# EAGLE schematic EE445L_Baseline_Schematic (EAGLE 9.6.2)
Fall 2021 EE445L This is the baseline schematic
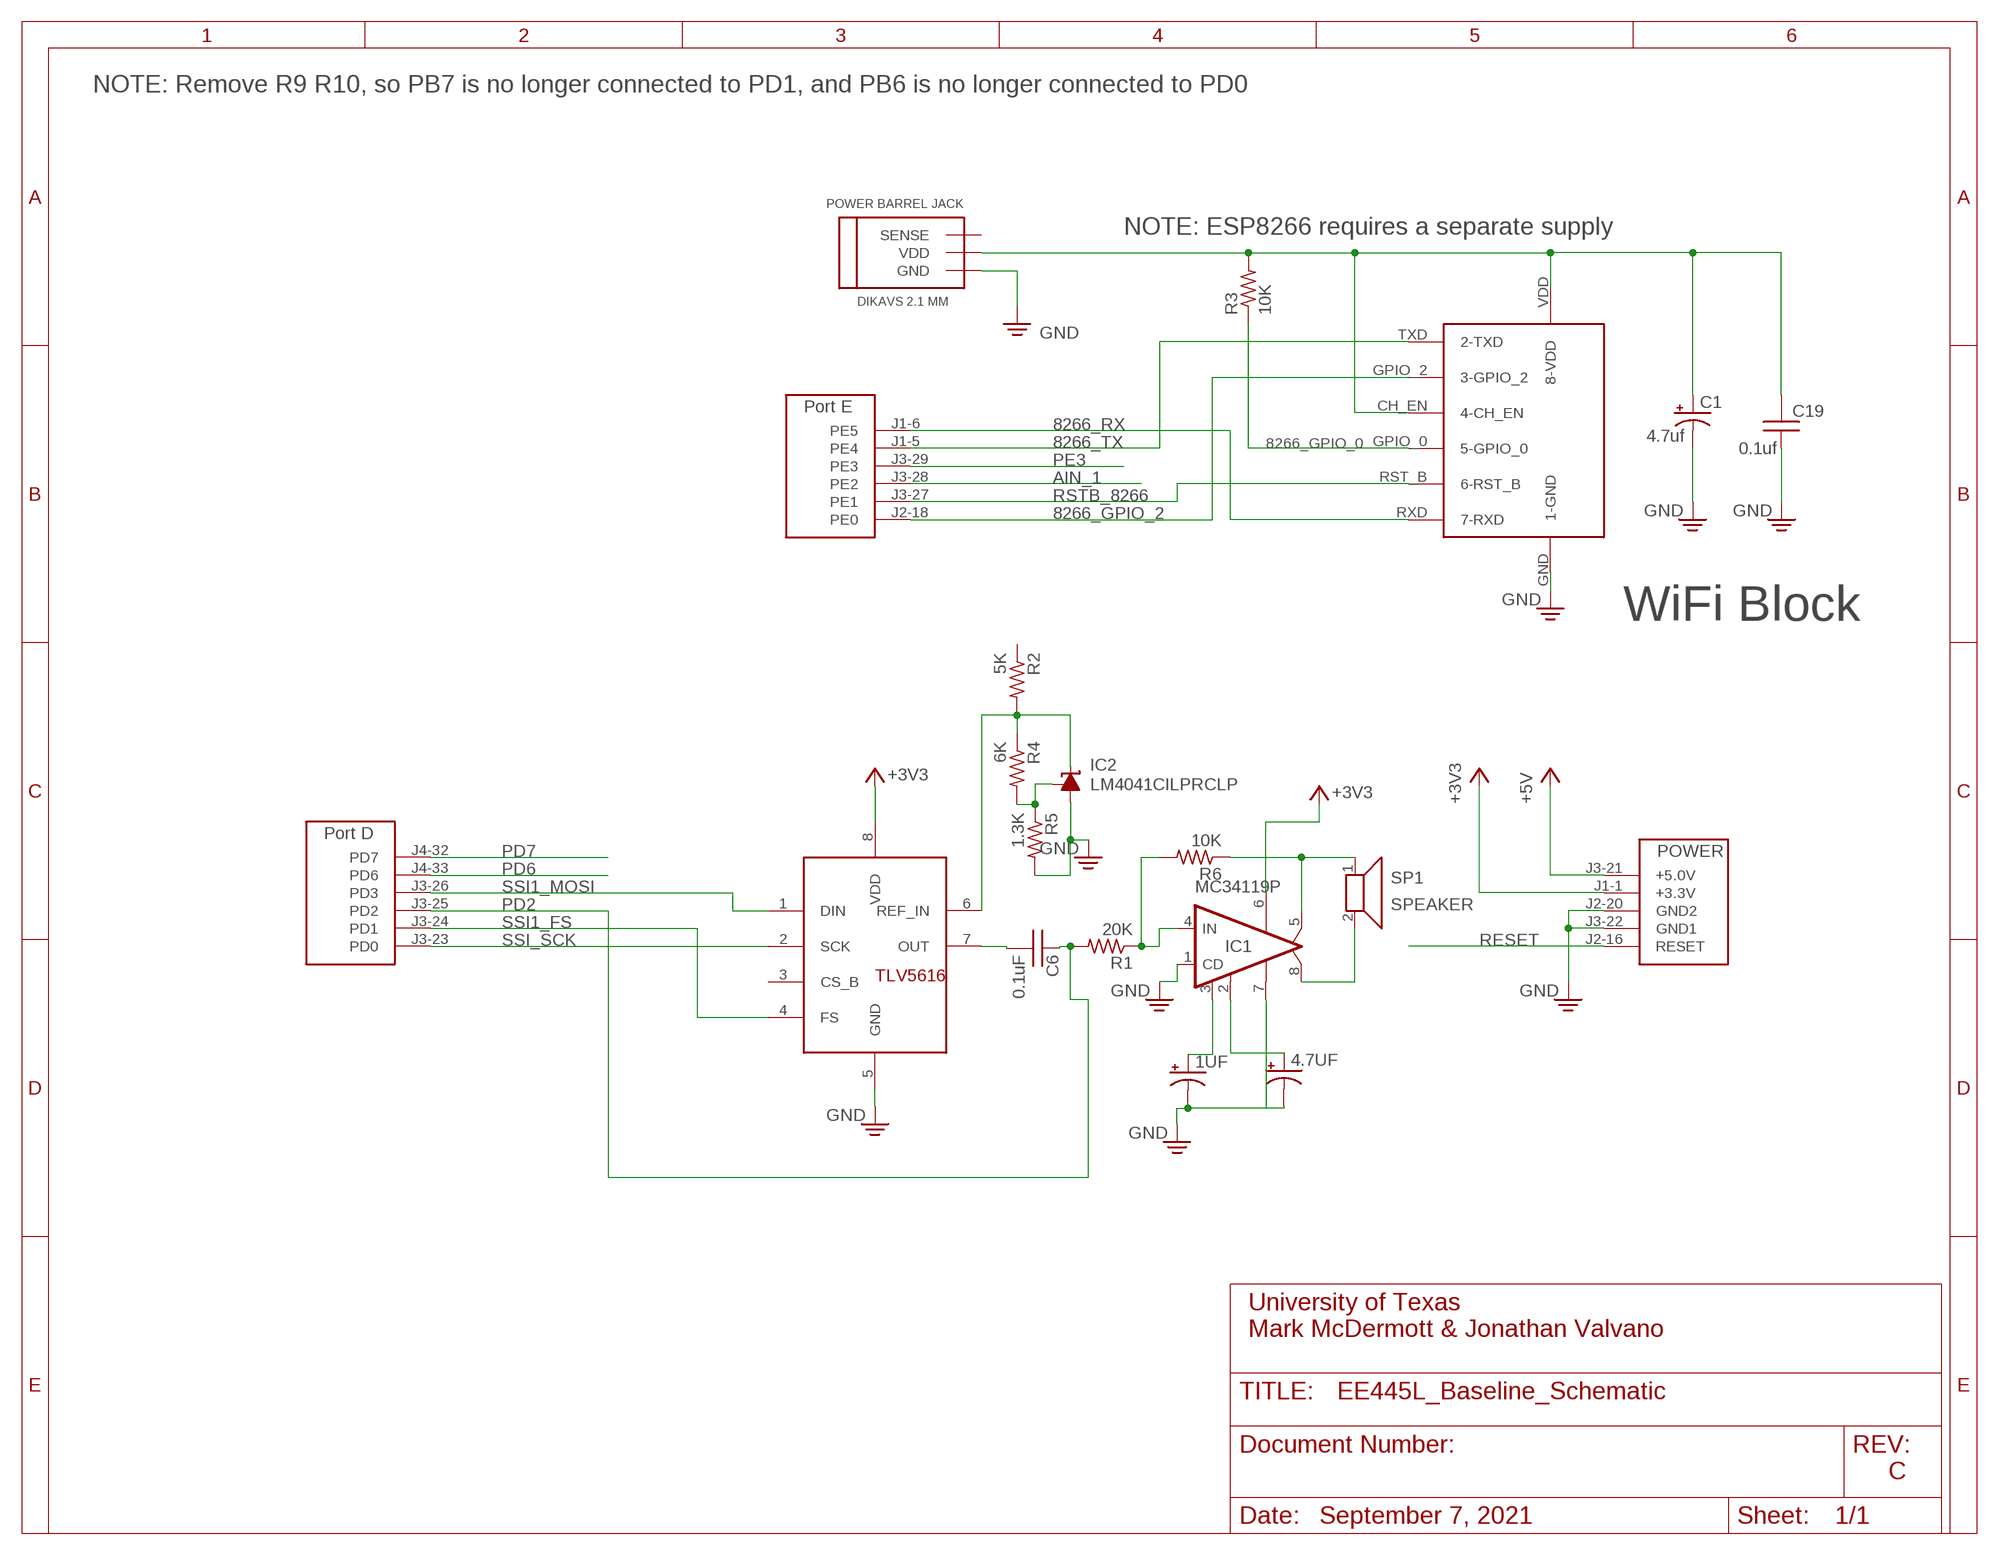
[diagram p0: schematic, sheet 1, part 1 of 2]
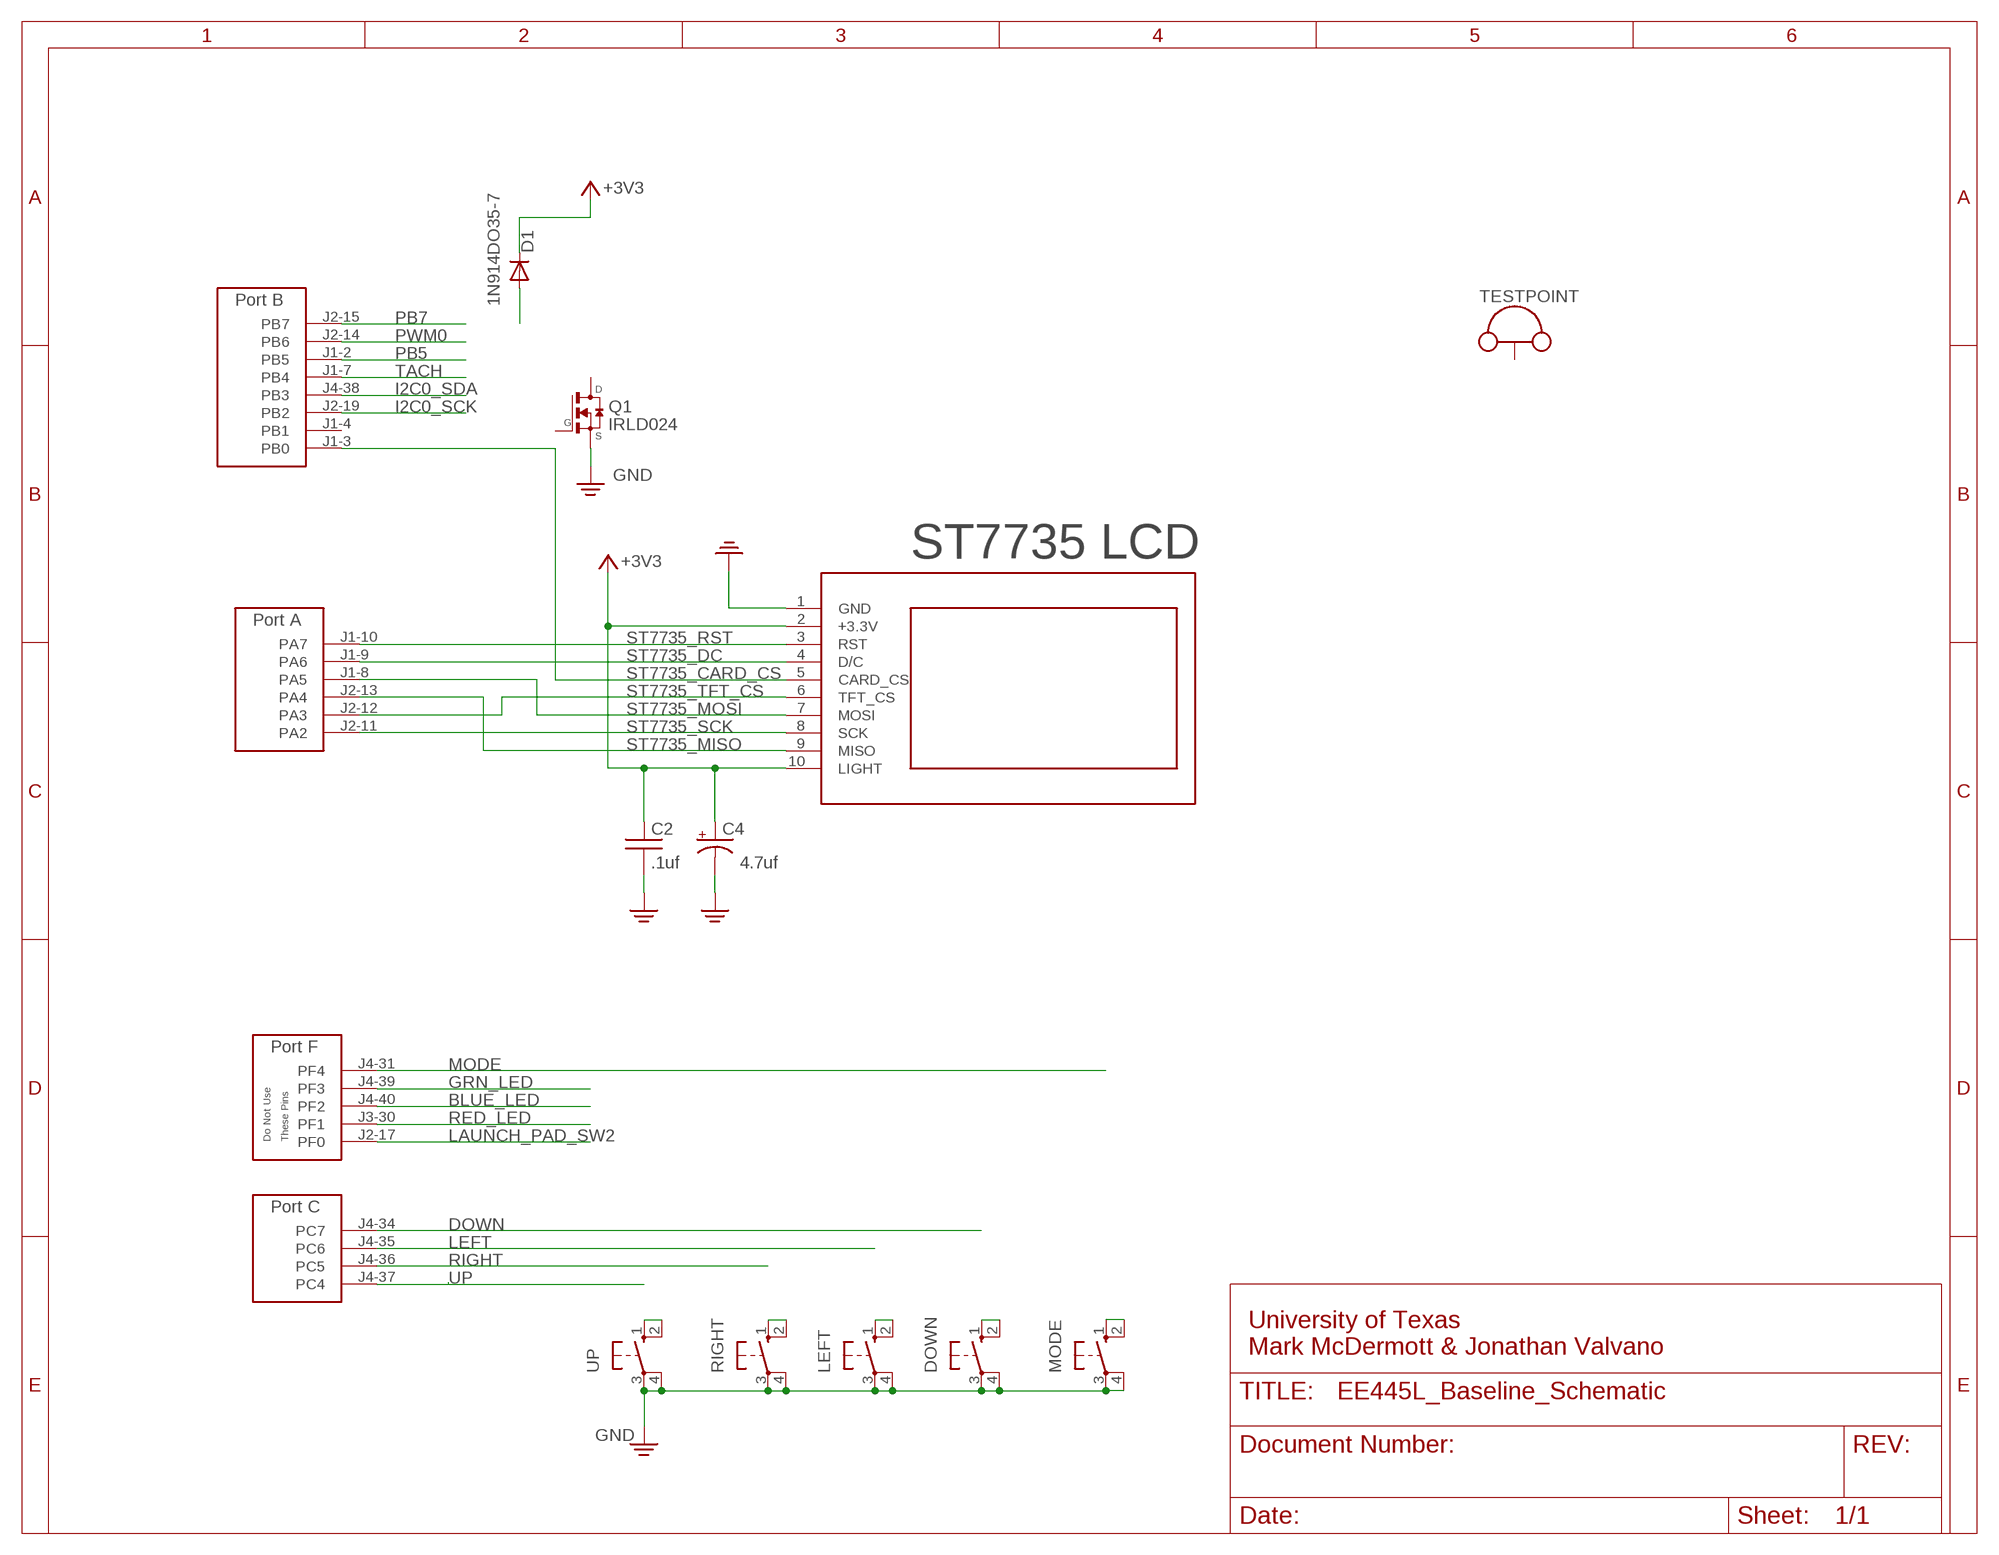
[diagram p1: schematic, sheet 1, part 2 of 2]

## Parts
1UF  CAPACITOR_POLARIZEDE5-6  [CAP200MILPOLARIZED]
4.7UF  CAPACITOR_POLARIZEDE5-6  [CAP200MILPOLARIZED]
C1  4.7uf  CAPACITOR_POLARIZEDE5-6  [CAP200MILPOLARIZED]
C2  .1uf  CAPACITOR050-024X044  [CAP200MIL]
C4  4.7uf  CAPACITOR_POLARIZEDE5-6  [CAP200MILPOLARIZED]
C6  0.1uF  CAPACITOR025-024X044  [CAP100MIL]
C19  0.1uf  CAPACITOR050-024X044  [CAP200MIL]
D1  1N914DO35-7  [DO35-7]
DOWN  B3F-1052  [B3F-10XX]
IC1  MC34119P  [DIL08]
IC2  LM4041CILPRCLP  [LP_O-PBCY-W3]
LEFT  B3F-1052  [B3F-10XX]
MODE  B3F-1052  [B3F-10XX]
Q1  IRLD024  [IRLD024]
R1  20K  RESISTOR0204/7  [RES300MIL]
R2  5K  RESISTOR0204/7  [RES300MIL]
R3  10K  RESISTOR0204/7  [RES300MIL]
R4  6K  RESISTOR0204/7  [RES300MIL]
R5  1.3K  RESISTOR0204/7  [RES300MIL]
R6  10K  RESISTOR0204/7  [RES300MIL]
RIGHT  B3F-1052  [B3F-10XX]
SP1  SPEAKER  [1X02]
TESTPOINT  TP_LOOP  [TP_LOOP]
U$1  ESP_8266  [ESP8266]
U$2  TM4C_BP  [TM4C_BOOSTER_PACK]
U$3  ST7735  [ST7735]
U$4  2.1MM_BARREL_JACK  [2.1M_BARREL_JACK]
U$5  TLV5616  [DIL08]
UP  B3F-1052  [B3F-10XX]

## Nets
8266_GPIO_0: R3.1 U$1.GPIO_0(5-GPIO_0)
8266_GPIO_2: U$1.GPIO_2(3-GPIO_2) U$2.J2-18(PE0)
8266_RX: U$1.RXD(7-RXD) U$2.J1-6(PE5)
8266_TX: U$1.TXD(2-TXD) U$2.J1-5(PE4)
+3V3: C2.1 C4.+ D1.C IC1.6(VCC) U$2.J1-1(+3.3V) U$3.2(+3.3V) U$3.10(LIGHT) U$5.8(VDD)
+5V: U$2.J3-21(+5.0V)
AIN_1: U$2.J3-28(PE2)
BLUE_LED: U$2.J4-40(PF2)
DOWN: U$2.J4-34(PC7)
GND: 1UF.- 4.7UF.- C1.- C2.2 C4.- C19.1 DOWN.3(P) DOWN.4(P1) IC1.1(CD) IC1.7(GND) IC2.3(A) LEFT.3(P) LEFT.4(P1) MODE.3(P) MODE.4(P1) Q1.P$4(S) R5.2 RIGHT.3(P) RIGHT.4(P1) U$1.GND(1-GND) U$2.J2-20(GND2) U$2.J3-22(GND1) U$3.1(GND) U$4.GND U$5.5(GND) UP.3(P) UP.4(P1)
GRN_LED: U$2.J4-39(PF3)
I2C0_SCK: U$2.J2-19(PB2)
I2C0_SDA: U$2.J4-38(PB3)
LAUNCH_PAD_SW2: U$2.J2-17(PF0)
LEFT: U$2.J4-35(PC6)
MODE: U$2.J4-31(PF4)
N$1: IC1.8(VO2) SP1.2
N$2: C1.+ C19.2 R3.2 U$1.CH_EN(4-CH_EN) U$1.VDD(8-VDD) U$4.VDD
N$3: LEFT.1(S) LEFT.2(S1)
N$4: DOWN.1(S) DOWN.2(S1)
N$5: MODE.1(S) MODE.2(S1)
N$6: RIGHT.1(S) RIGHT.2(S1)
N$7: UP.1(S) UP.2(S1)
N$9: C6.2 U$5.7(OUT)
N$10: IC1.4(IN) R1.1 R6.2
N$11: IC2.2(C) R2.2 R4.1 U$5.6(REF_IN)
N$12: 1UF.+ IC1.3(FC1)
N$13: IC2.1(FB) R4.2 R5.1
N$14: 4.7UF.+ IC1.2(FC2)
N$15: IC1.5(VO1) R6.1 SP1.1
N$16: D1.A
PB5: U$2.J1-2(PB5)
PB7: U$2.J2-15(PB7)
PD2: C6.1 R1.2 U$2.J3-25(PD2)
PD6: U$2.J4-33(PD6)
PD7: U$2.J4-32(PD7)
PE3: U$2.J3-29(PE3)
PWM0: U$2.J2-14(PB6)
RED_LED: U$2.J3-30(PF1)
RESET: U$2.J2-16(RESET)
RIGHT: U$2.J4-36(PC5)
RSTB_8266: U$1.RST_B(6-RST_B) U$2.J3-27(PE1)
SSI1_FS: U$2.J3-24(PD1) U$5.4(FS)
SSI1_MOSI: U$2.J3-26(PD3) U$5.1(DIN)
SSI_SCK: U$2.J3-23(PD0) U$5.2(SCK)
ST7735_CARD_CS: U$2.J1-3(PB0) U$3.5(CARD_CS)
ST7735_DC: U$2.J1-9(PA6) U$3.4(D/C)
ST7735_MISO: U$2.J2-13(PA4) U$3.9(MISO)
ST7735_MOSI: U$2.J1-8(PA5) U$3.7(MOSI)
ST7735_RST: U$2.J1-10(PA7) U$3.3(RST)
ST7735_SCK: U$2.J2-11(PA2) U$3.8(SCK)
ST7735_TFT_CS: U$2.J2-12(PA3) U$3.6(TFT_CS)
TACH: U$2.J1-7(PB4)
UP: U$2.J4-37(PC4)
Unconnected: Q1.P$1(D) Q1.P$3(G) R2.1 TESTPOINT.P$1(TP) TESTPOINT.P$2(TP) U$2.J1-4(PB1) U$4.SENSE U$5.3(CS_B)

## Notes on the sheet
- NOTE: Remove R9 R10, so PB7 is no longer connected to PD1, and PB6 is no longer connected to PD0
- NOTE: ESP8266 requires a separate supply
- ST7735 LCD
- WiFi Block
- University of Texas
  Mark McDermott & Jonathan Valvano
- University of Texas
  Mark McDermott & Jonathan Valvano
- C
- September 7, 2021

## Library data of the parts
1UF 4.7UF C1 C4 = EE445L:CAPACITOR_POLARIZED: POLARIZED CAPACITOR, American symbol
C2 C6 C19 = EE445L:CAPACITOR: CAPACITOR, American symbol
D1 = EE445L:1N914: DIODE high speed (Philips) 1N914
DOWN LEFT MODE RIGHT UP = EE445L:B3F-1052: OMRON SWITCH 1.1mm holes; MPN: B3F-1000; OC_FARNELL: 176432; OC_NEWARK: 36M3542
IC1 = EE445L:MC34119: Low Power Audio Amplifier Motorola
IC2 = EE445L:LM4041CILPR: PRECISION MICROPOWER SHUNT VOLTAGE REFERENCE Adjustable Output Source: http://focus.ti.com/lit/ds/slcs146e/slcs146e.pdf LM4041CILPR Let R1 be the resistor from Vref to +3.3V Let R2 be the resistor from Vref to FB Let R3 be the resistor from FB to ground Vref = 1.23*(1+R3/R2) Iref=(3.3V-Vref)/R1 - 100uA; MPN: LM4041CILP; OC_FARNELL: 1673945; OC_NEWARK: 50M8856
Q1 = EE445L:IRLD024: N-Channel Enhancement MOSFET
R1-R6 = EE445L:RESISTOR: RESISTOR, American symbol
SP1 = EE445L:SPEAKER: Speaker Connected off PCB with two wires. 32-ohm speaker, AllElectronics, SK-230, http://www.allelectronics.com/make-a-store/item/sk-230/20-mm-32-ohm-speaker/1.html
TESTPOINT = EE445L:TP_LOOP
U$1 = EE445L:ESP_8266
U$2 = EE445L:TM4C_BP
U$3 = EE445L:ST7735
U$4 = EE445L:2.1MM_BARREL_JACK
U$5 = EE445L:TLV5616